# Altium schematic sheet PH-2A_C23191_PH-2A_C2319.schdoc
size 127 x 99 mm
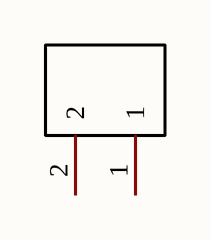
[diagram p0: PH-2A_C23191_PH-2A_C2319.schdoc]

## Parts
P?  PH-2A  (value not drawn)

## Nets

Not connected (* = marked no-connect by the designer): P? 1 2

## Library data of the parts
P? = PH-2A: Manufacturer: BOOMELE(博穆精密); Symbol: PH-2A_C2319; Add into BOM: yes; Reference Series: PH; Pitch: 2mm; Pins Structure: 1x2P; Number of PINs Per Row: 2; Name: PH-2A; Device: PH-2A; LCSC Part Name: PH-2A 2P 脚距2.0mm 直插 直插; Supplier Part: C2319; Manufacturer Part: PH-2A; Supplier Footprint: 插件,P=2mm; JLCPCB Part Class: Extended Part; Datasheet: https://atta.szlcsc.com/upload/public/pdf/source/20151208/1457707613620.pdf; Supplier: LCSC; Convert to PCB: yes; Number of Rows: 1; Row Spacing: -; Mounting Style: -; Contact Material: -